# Altium schematic sheet 温度报警器.SchDoc
size A4
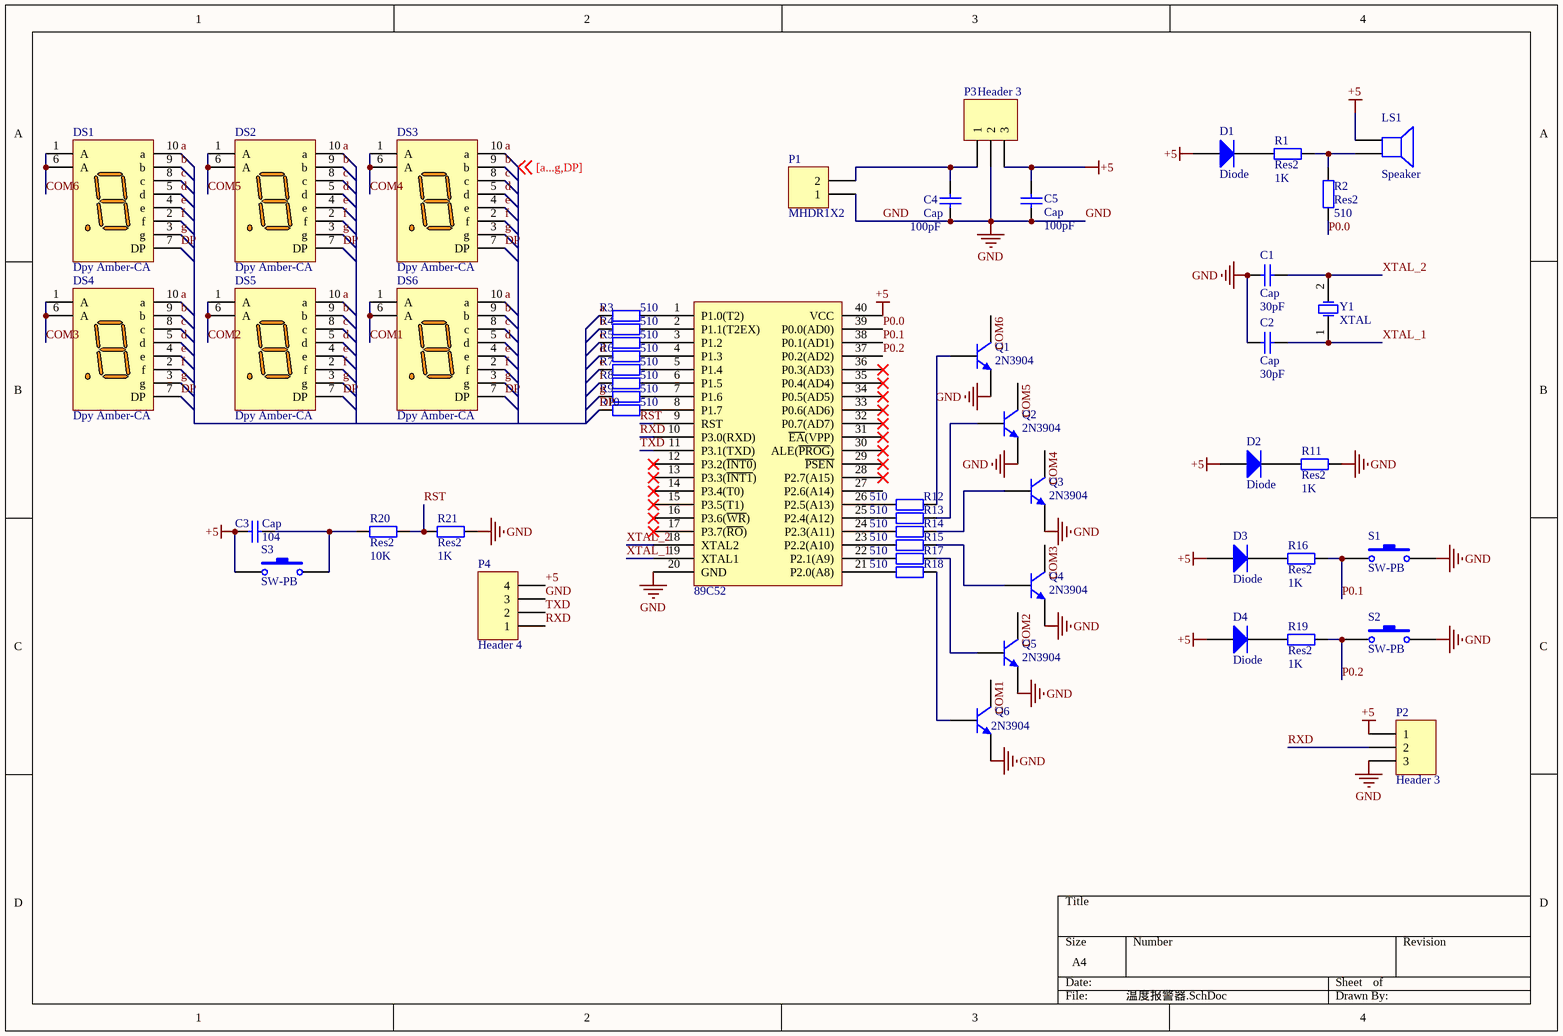
[diagram p0: 温度报警器.SchDoc]

## Parts
?  89C52  [DIP40]
C1  Cap  value 30pF  [0805C]
C2  Cap  value 30pF  [0805C]
C3  Cap  value 104  [0805C]
C4  Cap  value 100pF  [C 0805_M]
C5  Cap  value 100pF  [C 0805_M]
D1  Diode  [LED 0805W]
D2  Diode  [LED 0805W]
D3  Diode  [LED 0805W]
D4  Diode  [LED 0805W]
DS1  Dpy Amber-CA  [数码管 - aaa]
DS2  Dpy Amber-CA  [数码管 - aaa]
DS3  Dpy Amber-CA  [数码管 - aaa]
DS4  Dpy Amber-CA  [数码管 - aaa]
DS5  Dpy Amber-CA  [数码管 - aaa]
DS6  Dpy Amber-CA  [数码管 - aaa]
LS1  Speaker  [PIN2]
P1  MHDR1X2  [KF350-2P]
P2  Header 3  [HDR2.54-LI-3P]
P3  Header 3  [TO220A]
P4  Header 4  [HDR2.54-LI-4P]
Q1  2N3904  [TO-92A]
Q2  2N3904  [TO-92A]
Q3  2N3904  [TO-92A]
Q4  2N3904  [TO-92A]
Q5  2N3904  [TO-92A]
Q6  2N3904  [TO-92A]
R1  Res2  value 1K  [0805R]
R2  Res2  value 510  [0805R]
R3  value 510  [0805R]  (hidden comment: Res2)
R4  value 510  [0805R]  (hidden comment: Res2)
R5  value 510  [0805R]  (hidden comment: Res2)
R6  value 510  [0805R]  (hidden comment: Res2)
R7  value 510  [0805R]  (hidden comment: Res2)
R8  value 510  [0805R]  (hidden comment: Res2)
R9  value 510  [0805R]  (hidden comment: Res2)
R10  value 510  [0805R]  (hidden comment: Res2)
R11  Res2  value 1K  [0805R]
R12  value 510  [0805R]  (hidden comment: Res2)
R13  value 510  [0805R]  (hidden comment: Res2)
R14  value 510  [0805R]  (hidden comment: Res2)
R15  value 510  [0805R]  (hidden comment: Res2)
R16  Res2  value 1K  [0805R]
R17  value 510  [0805R]  (hidden comment: Res2)
R18  value 510  [0805R]  (hidden comment: Res2)
R19  Res2  value 1K  [0805R]
R20  Res2  value 10K  [0805R]
R21  Res2  value 1K  [0805R]
S1  SW-PB  [TSW DIP-6*6*6]
S2  SW-PB  [TSW DIP-6*6*6]
S3  SW-PB  [TSW DIP-6*6*6]
Y1  XTAL  [OSC HC-49S]

## Nets
+5: ?.40(VCC) C3.1 C5.2 D1.1(A) D2.1(A) D3.1(A) D4.1(A) LS1.1 P2.1 P3.3 P4.4 S3.1
GND: ?.20(GND) C1.1 C2.1 C4.1 C5.1 P1.1 P2.3 P3.2 P4.3 Q1.1(E) Q2.1(E) Q3.1(E) Q4.1(E) Q5.1(E) Q6.1(E) R11.2 R21.2 S1.2 S2.2
a: DS1.10(a) DS2.10(a) DS3.10(a) DS4.10(a) DS5.10(a) DS6.10(a) R3.1
b: DS1.9(b) DS2.9(b) DS3.9(b) DS4.9(b) DS5.9(b) DS6.9(b) R4.1
c: DS1.8(c) DS2.8(c) DS3.8(c) DS4.8(c) DS5.8(c) DS6.8(c) R5.1
COM1: DS6.1(A) DS6.6(A) Q6.3(C)
COM2: DS5.1(A) DS5.6(A) Q5.3(C)
COM3: DS4.1(A) DS4.6(A) Q4.3(C)
COM4: DS3.1(A) DS3.6(A) Q3.3(C)
COM5: DS2.1(A) DS2.6(A) Q2.3(C)
COM6: DS1.1(A) DS1.6(A) Q1.3(C)
d: DS1.5(d) DS2.5(d) DS3.5(d) DS4.5(d) DS5.5(d) DS6.5(d) R6.1
DP: DS1.7(DP) DS2.7(DP) DS3.7(DP) DS4.7(DP) DS5.7(DP) DS6.7(DP) R10.1
e: DS1.4(e) DS2.4(e) DS3.4(e) DS4.4(e) DS5.4(e) DS6.4(e) R7.1
f: DS1.2(f) DS2.2(f) DS3.2(f) DS4.2(f) DS5.2(f) DS6.2(f) R8.1
g: DS1.3(g) DS2.3(g) DS3.3(g) DS4.3(g) DS5.3(g) DS6.3(g) R9.1
P0.0: ?.39(P0.0(AD0)) R2.1
P0.1: ?.38(P0.1(AD1)) R16.2 S1.1
P0.2: ?.37(P0.2(AD2)) R19.2 S2.1
RST: ?.9(RST) R20.2 R21.1
RXD: ?.10(P3.0(RXD)) P2.2 P4.1
TXD: ?.11(P3.1(TXD)) P4.2
XTAL_1: ?.19(XTAL1) C2.2 Y1.1(OSC1)
XTAL_2: ?.18(XTAL2) C1.2 Y1.2(OSC2)
Net?_1: ?.1(P1.0(T2)) R3.2
Net?_2: ?.2(P1.1(T2EX)) R4.2
Net?_3: ?.3(P1.2) R5.2
Net?_4: ?.4(P1.3) R6.2
Net?_5: ?.5(P1.4) R7.2
Net?_6: ?.6(P1.5) R8.2
Net?_7: ?.7(P1.6) R9.2
Net?_8: ?.8(P1.7) R10.2
Net?_21: ?.21(P2.0(A8)) R18.1
Net?_22: ?.22(P2.1(A9)) R17.1
Net?_23: ?.23(P2.2(A10)) R15.1
Net?_24: ?.24(P2.3(A11)) R14.1
Net?_25: ?.25(P2.4(A12)) R13.1
Net?_26: ?.26(P2.5(A13)) R12.1
NetC3_2: C3.2 R20.1 S3.2
NetC4_2: C4.2 P1.2 P3.1
NetD1_2: D1.2(K) R1.1
NetD2_2: D2.2(K) R11.1
NetD3_2: D3.2(K) R16.1
NetD4_2: D4.2(K) R19.1
NetLS1_2: LS1.2 R1.2 R2.2
NetQ1_2: Q1.2(B) R12.2
NetQ2_2: Q2.2(B) R13.2
NetQ3_2: Q3.2(B) R14.2
NetQ4_2: Q4.2(B) R15.2
NetQ5_2: Q5.2(B) R17.2
NetQ6_2: Q6.2(B) R18.2

Not connected (* = marked no-connect by the designer): ? 12(P3.2(~{INT0}))* 13(P3.3(~{INT1}))* 14(P3.4(T0))* 15(P3.5(T1))* 16(P3.6(~{WR}))* 17(P3.7(~{RO}))* 27(P2.6(A14)) 28(P2.7(A15))* 29(~{PSEN})* 30(ALE(~{PROG}))* 31(~{EA}(VPP))* 32(P0.7(AD7))* 33(P0.6(AD6))* 34(P0.5(AD5))* 35(P0.4(AD4))* 36(P0.3(AD3))*

## Notes on the sheet
- Labels drawn without touching a wire or pin: [a...g,DP]

## Library data of the parts
C1-C5 = Cap: Capacitor; Published: 8-Jun-2000; LatestRevisionDate: 17-Jul-2002; LatestRevisionNote: Re-released for DXP Platform.; PackageReference: RAD-0.3; Publisher: Altium Limited; PackageDescription: Radial Cap, Thru-Hole; 2 Leads; 0.3 in Pin Spacing
D1-D4 = Diode: Default Diode; Published: 8-Jun-2000; LatestRevisionDate: 17-Jul-2002; LatestRevisionNote: Re-released for DXP Platform.; PackageVersion: Sep-1996; PackageReference: SMC; Publisher: Altium Limited; PackageDescription: DO-214-AB/SMC; 2 C-Bend Leads; Body 7.9 x 5.9 mm, inc. leads (LxW); Code_JEDEC: DO-214-AB
DS1-DS6 = Dpy Amber-CA: 7.62 mm Black Surface Orange 7-Segment Display: CA, RH DP; MinimumIntensity: 354 ucd; Note: IF = 5 mA; Note: Pins 1 and 6 are redundant Anodes.; Published: 8-Jun-2000; LatestRevisionDate: 17-Dec-2003; LatestRevisionNote: Schematic revised, PCB Footprint replaced.; DatasheetVersion: 19-Feb-2002; PackageVersion: 11-Feb-2002; PackageReference: A; Publisher: Altium Limited; PackageDescription: LED, 7-Segment Display, 7.62 mm, RHD; 10 Leads; Row Space 5.08 mm; Pitch 2.54 mm; Colour: Orange; ComponentLink1Description: Manufacturer Link; ComponentLink1URL: http://www.agilent.com/
LS1 = Speaker: Loudspeaker; Published: 24-Mar-1999; LatestRevisionDate: 17-Jul-2002; LatestRevisionNote: Re-released for DXP Platform.; PackageReference: PIN2; Publisher: Altium Limited
P1 = MHDR1X2: Header, 2-Pin; LatestRevisionDate: 17-Jul-2002; LatestRevisionNote: Re-released for DXP Platform.; Publisher: Altium Limited
P2 P3 = Header 3: Header, 3-Pin; LatestRevisionDate: 17-Jul-2002; LatestRevisionNote: Re-released for DXP Platform.; Publisher: Altium Limited
P4 = Header 4: Header, 4-Pin; LatestRevisionDate: 17-Jul-2002; LatestRevisionNote: Re-released for DXP Platform.; Publisher: Altium Limited
Q1-Q6 = 2N3904: NPN General Purpose Amplifier; Published: 8-Jun-2000; LatestRevisionDate: 15-Jan-2003; LatestRevisionNote: PCB Footprint 'BCY-W3/D4.7' replaced; DatasheetVersion: 1997; PackageVersion: Sep-1998; PackageReference: TO-92A; Publisher: Altium Limited; PackageDescription: TO, Flat Index; 3 In-Line, Axial Leads; Body Dia. 4.5mm; Leads 0.51 x 0.48 mm (max); ComponentLink1Description: Manufacturer Link; ComponentLink1URL: http://www.fairchildsemi.com/; ComponentLink2Description: Datasheet; ComponentLink2URL: http://www.fairchildsemi.com/ds/2N%2F2N3904.pdf
R1-R21 = Res2: Resistor; Published: 8-Jun-2000; LatestRevisionDate: 17-Jul-2002; LatestRevisionNote: Re-released for DXP Platform.; PackageReference: AXIAL-0.4; Publisher: Altium Limited; PackageDescription: Axial Device, Thru-Hole; 2 Leads; 0.4 in Pin Spacing
S1-S3 = SW-PB: Switch; pin to pad: 1>1+3 2>2+4; Published: 24-Mar-1999; LatestRevisionDate: 17-Jul-2002; LatestRevisionNote: Re-released for DXP Platform.; PackageReference: SPST-2; Publisher: Altium Limited; PackageDescription: Switch; 2 Leads
Y1 = XTAL: Crystal Oscillator; Published: 8-Jun-2000; LatestRevisionDate: 17-Jul-2002; LatestRevisionNote: Re-released for DXP Platform.; PackageReference: R38; Publisher: Altium Limited; PackageDescription: Crystal, Thru-Hole; 2 Leads; Body 3.1 x 8.2 mm (Dia.xH)